# EAGLE schematic current_meas (EAGLE 9.0.1)
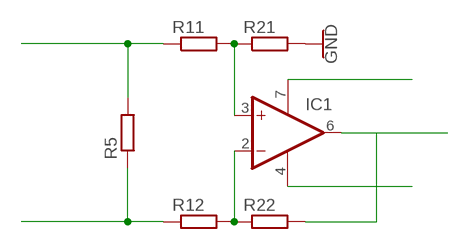
[diagram p0: schematic, sheet 1]

## Parts
IC1  1AMP_P7+4D  [SO08]
R5  R-EU_M1406  [M1406]
R11  R-EU_M1406  [M1406]
R12  R-EU_M1406  [M1406]
R21  R-EU_M1406  [M1406]
R22  R-EU_M1406  [M1406]

## Nets
GND: R21.2
N$1: IC1.3(+IN) R11.2 R21.1
N$2: IC1.2(-IN) R12.2 R22.1
N$3: IC1.6(OUT) R22.2
N$4: IC1.7(V+)
N$5: R5.2 R11.1
N$6: R5.1 R12.1
N$7: IC1.4(V-)

## Library data of the parts
IC1 = linear:1AMP_P7+4: OP AMP
R5 R11 R12 R21 R22 = resistor:R-EU_: RESISTOR, European symbol